# EAGLE design DualEncoderBoard-v1.0 (EAGLE 6.5.0)
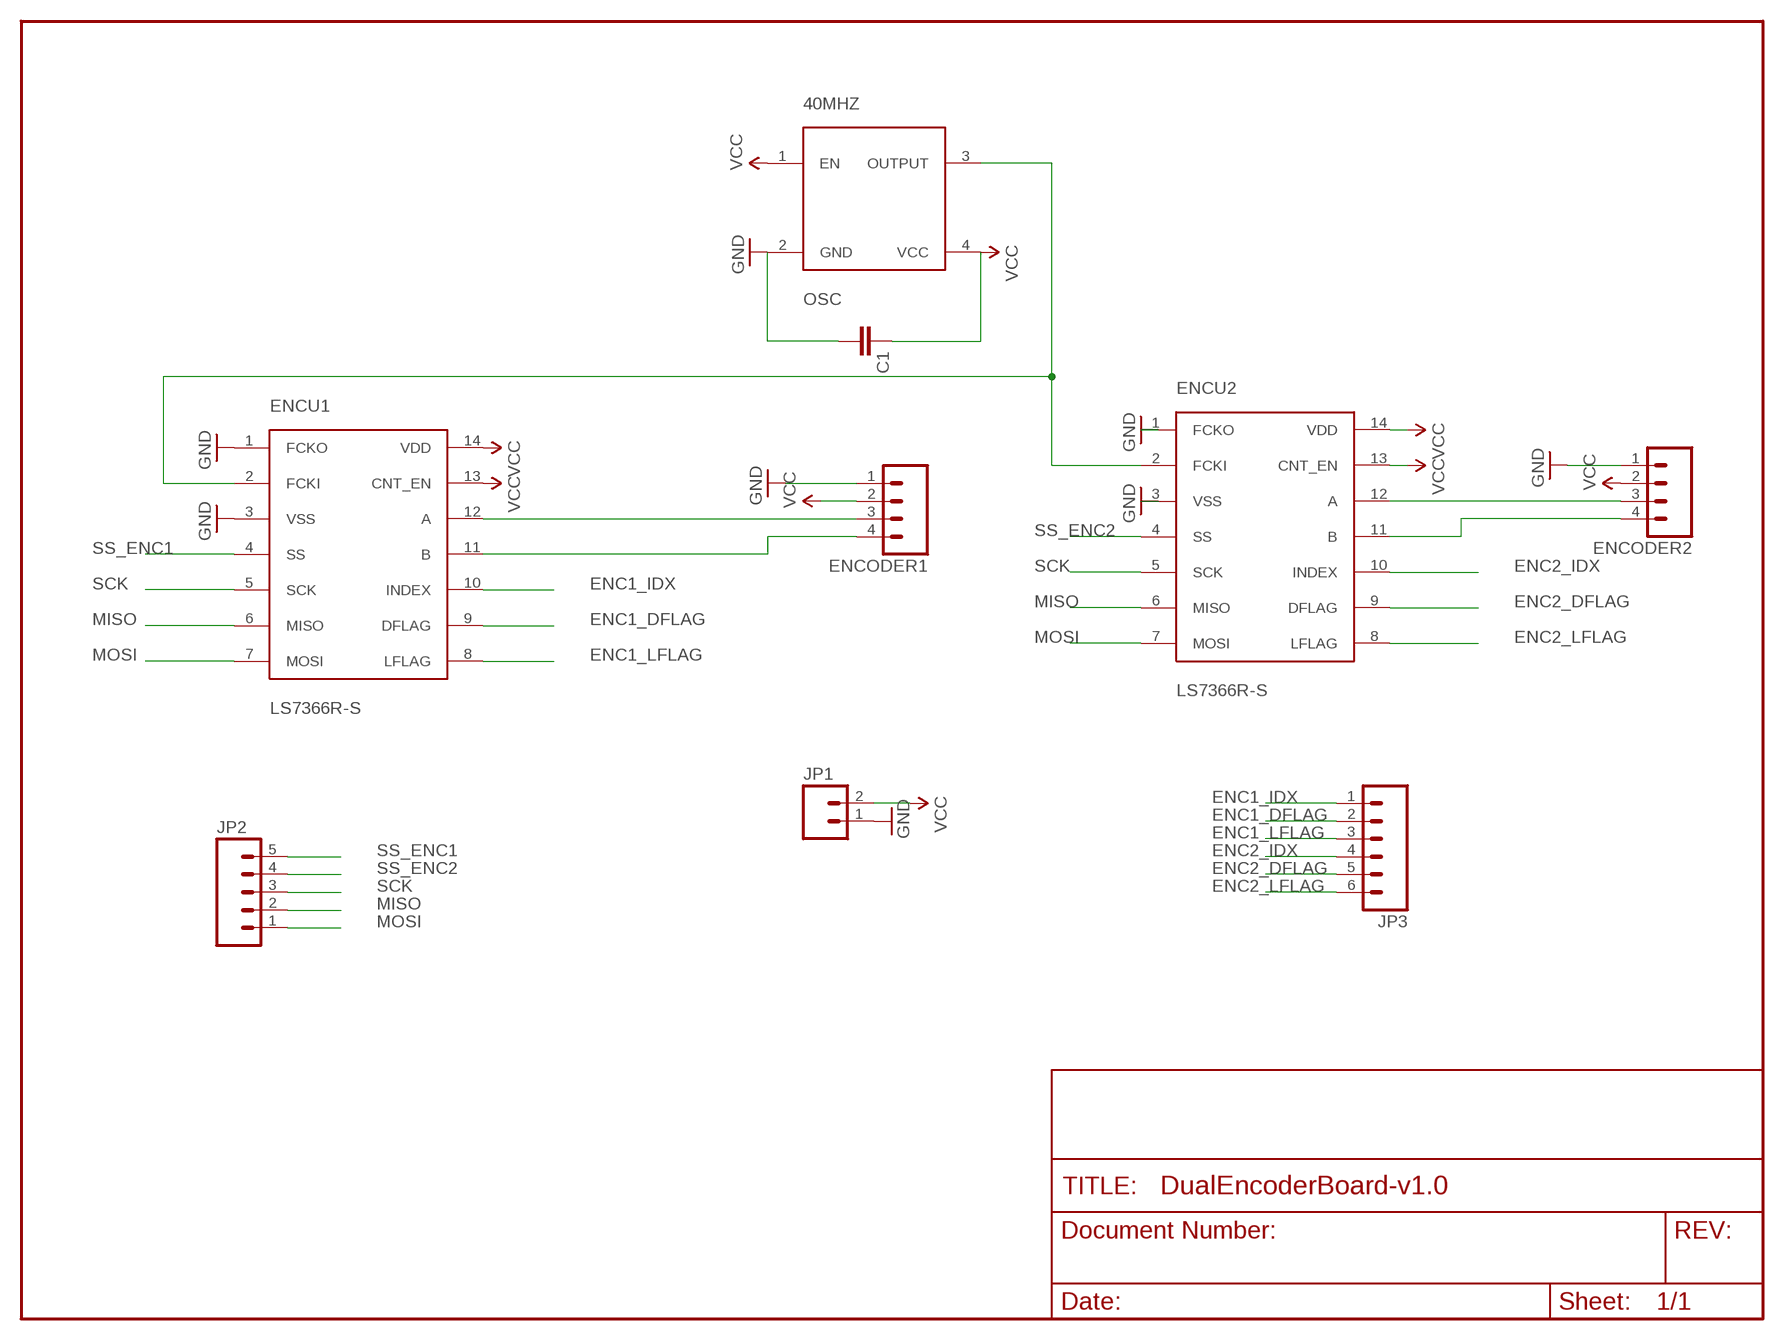
[diagram p0: schematic, sheet 1]

## Parts
40MHZ  OSC  [CB3OSCILLATOR]
C1  CAPKIT  [CAP-PTH-SMALL-KIT]
ENCODER1  M04POLAR  [MOLEX-1X4]
ENCODER2  M04POLAR  [MOLEX-1X4]
ENCU1  LS7366R-S  [SO14]
ENCU2  LS7366R-S  [SO14]
JP1  M02-JST-2MM-SMT  [JST-2-SMD]
JP2  M05PTH  [1X05]
JP3  M06SIP  [1X06]

## Nets
ENC1_DFLAG: ENCU1.9(DFLAG) JP3.2
ENC1_IDX: ENCU1.10(INDEX) JP3.1
ENC1_LFLAG: ENCU1.8(LFLAG) JP3.3
ENC2_DFLAG: ENCU2.9(DFLAG) JP3.5
ENC2_IDX: ENCU2.10(INDEX) JP3.4
ENC2_LFLAG: ENCU2.8(LFLAG) JP3.6
GND: 40MHZ.2(GND) C1.2 ENCODER1.1 ENCODER2.1 ENCU1.1(FCKO) ENCU1.3(VSS) ENCU2.1(FCKO) ENCU2.3(VSS) JP1.1
MISO: ENCU1.6(MISO) ENCU2.6(MISO) JP2.2
MOSI: ENCU1.7(MOSI) ENCU2.7(MOSI) JP2.1
N$1: ENCODER1.3 ENCU1.12(A)
N$2: ENCODER1.4 ENCU1.11(B)
N$3: ENCODER2.3 ENCU2.12(A)
N$4: ENCODER2.4 ENCU2.11(B)
N$5: 40MHZ.3(OUTPUT) ENCU1.2(FCKI) ENCU2.2(FCKI)
SCK: ENCU1.5(SCK) ENCU2.5(SCK) JP2.3
SS_ENC1: ENCU1.4(SS) JP2.5
SS_ENC2: ENCU2.4(SS) JP2.4
VCC: 40MHZ.1(EN) 40MHZ.4(VCC) C1.1 ENCODER1.2 ENCODER2.2 ENCU1.13(CNT_EN) ENCU1.14(VDD) ENCU2.13(CNT_EN) ENCU2.14(VDD) JP1.2

## Library data of the parts
40MHZ = steveo:OSC: CB3 40mhz Oscillator smd
C1 = SparkFun:CAP: Capacitor Standard 0603 ceramic capacitor, and 0.1" leaded capacitor.
ENCODER1 ENCODER2 = SparkFun:M04: Header 4 Standard 4-pin 0.1" header. Use with straight break away headers (SKU : PRT-00116), right angle break away headers (PRT-00553), swiss pins (PRT-00743), machine pins (PRT-00117), and female headers (PRT-00115). Molex polarized connector foot print use with SKU : PRT-08231 with associated crimp pins and housings. 1MM SMD Version SKU: PRT-10208
ENCU1 ENCU2 = steveo:LS7366R-S
JP1 = SparkFun:M02: Header 2 Standard 2-pin 0.1" header. Use with straight break away headers (SKU : PRT-00116), right angle break away headers (PRT-00553), swiss pins (PRT-00743), machine pins (PRT-00117), and female headers (PRT-00115). Molex polarized connector foot print use with SKU : PRT-08233 with associated crimp pins and housings.
JP2 = SparkFun:M05: Header 5 Standard 5-pin 0.1" header. Use with straight break away headers (SKU : PRT-00116), right angle break away headers (PRT-00553), swiss pins (PRT-00743), machine pins (PRT-00117), and female headers (PRT-00115). Molex polarized connector foot print use with SKU : PRT-08230 with associated crimp pins and housings.
JP3 = SparkFun:M06: Header 6 Standard 6-pin 0.1" header. Use with straight break away headers (SKU : PRT-00116), right angle break away headers (PRT-00553), swiss pins (PRT-00743), machine pins (PRT-00117), and female headers (PRT-00115). Molex polarized connector foot print use with SKU : PRT-08094 with associated crimp pins and housings. NOTES ON THE VARIANTS LOCK and LOCK_LONGPADS... This footprint was designed to help hold the alignment of a through-hole component (i.e. 6-pin header) while soldering it into place. You may notice that each hole has been shifted either up or down by 0.005 of an inch from it's more standard position (which is a perfectly straight line). This slight alteration caused the pins (the squares in the middle) to touch the edges of the holes. Because they are alternating, it causes a "brace" to hold the component in place. 0.005 has proven to be the perfect amount of "off-center" position when using our standard breakaway headers. Although looks a little odd when you look at the bare footprint, once you have a header in there, the alteration is very hard to notice. Also, if you push a header all the way into place, it is covered up entirely on the bottom side. This idea of altering the position of holes to aid alignment will be further integrated into the Sparkfun Library for other footprints. It can help hold any component with 3 or more connection pins.

## Board
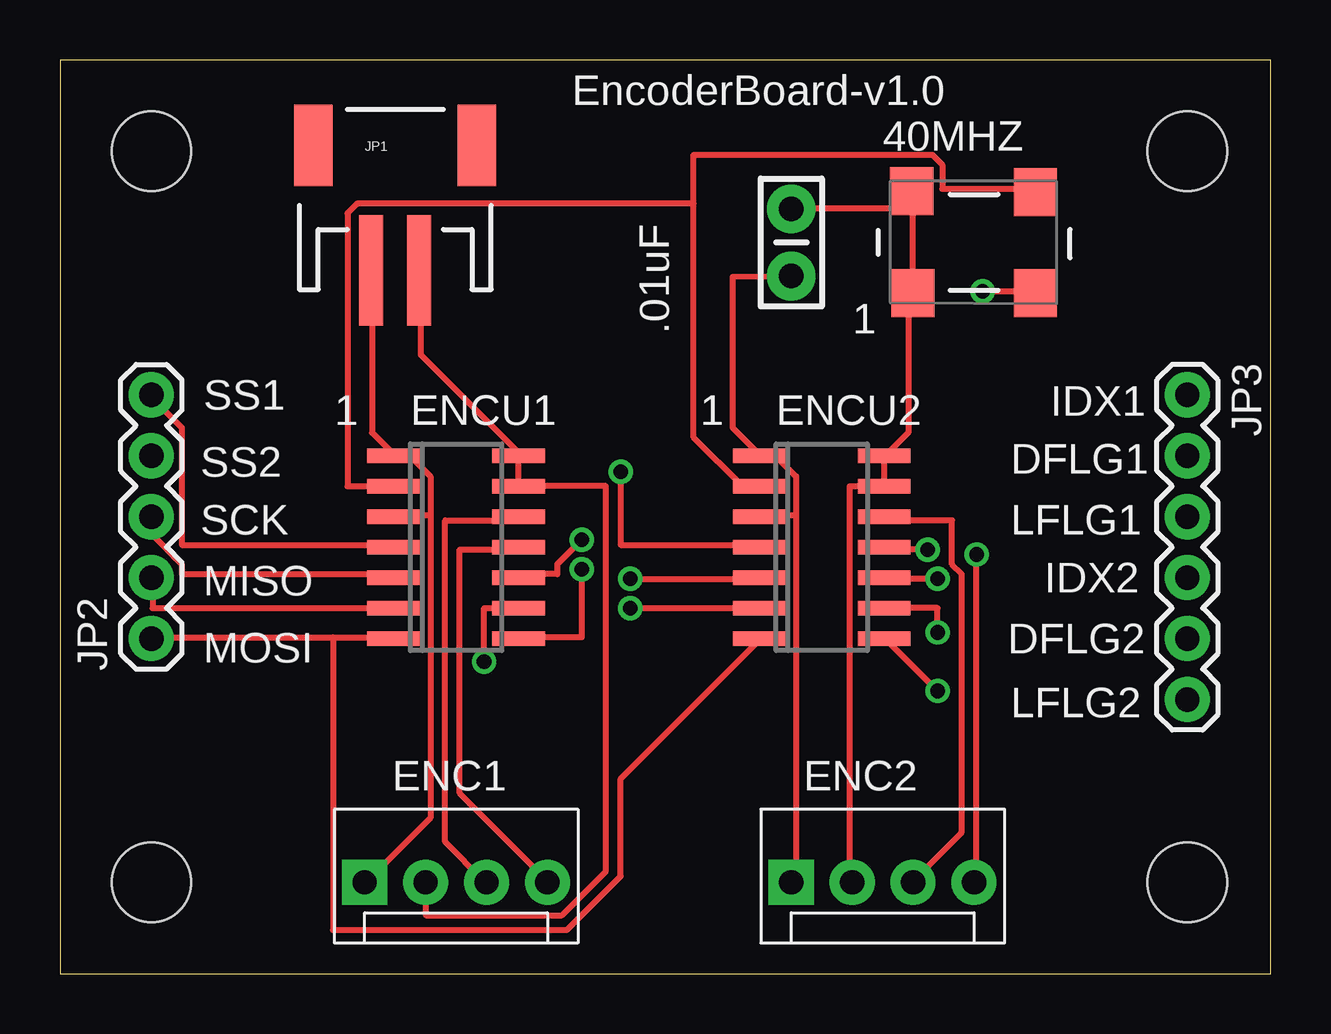
[diagram p1: board, top side]
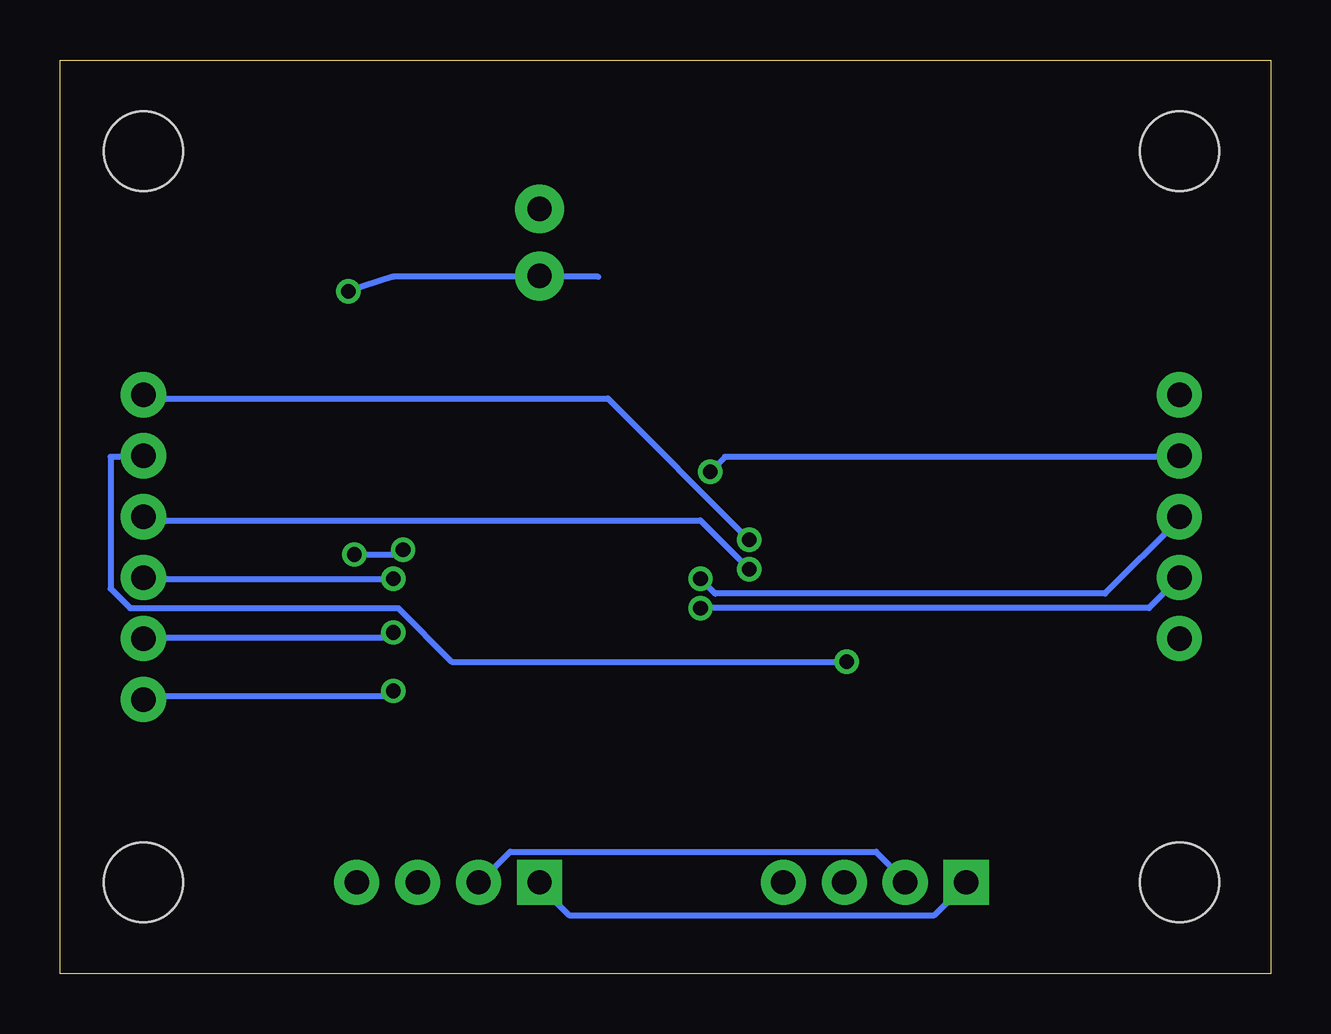
[diagram p2: board, bottom side, seen from below]

Size 50.47 x 38.09 mm. Coordinates in mm from the lower left corner, seen from the top.
Outline: 0,0 50.47,0 50.47,38.09 0,38.09 0,0
Copper layers (1*16): Top 0.035mm / dielectric 1.5mm / Bottom 0.035mm
Design rules "default": minimum track width 10mil, minimum drill 24mil, track to track 8mil, track to pad 8mil, pad to pad 8mil, via to via 8mil, smd to smd 8mil, copper to edge 40mil, drill to drill 8mil, minimum pad ring 10mil, minimum via ring 8mil, stop-mask expansion 4mil, vias tented up to drill 0mil, thermal gap 10mil

### Footprints (pad centres in the part's own frame; a part is rotated, then mirrored left to right if it is on the bottom)
CB3OSCILLATOR = smd 1.8 x 2: 1 -2.55,-2.1; 2 2.55,-2.1; 3 2.55,2.1; 4 -2.6,2.15
CAP-PTH-SMALL-KIT = drill 1.016 pad 2.032: 1 -1.397,0; 2 1.397,0
MOLEX-1X4 = drill 1.016 pad 1.88 square: 1 0,0 | drill 1.016 pad 1.88: 2 2.54,0; 3 5.08,0; 4 7.62,0
SO14 = smd 0.6 x 2.2: 1 -3.81,-2.6; 2 -2.54,-2.6; 3 -1.27,-2.6; 4 0,-2.6; 5 1.27,-2.6; 6 2.54,-2.6; 7 3.81,-2.6; 8 3.81,2.6; 9 2.54,2.6; 10 1.27,2.6; 11 0,2.6; 12 -1.27,2.6; 13 -2.54,2.6; 14 -3.81,2.6
JST-2-SMD = smd 1 x 4.6: 1 -1,-3.7; 2 1,-3.7 | smd 1.6 x 3.4: NC1 -3.4,1.5; NC2 3.4,1.5
1X05 = drill 1.016 pad 1.88: 1 0,0; 2 2.54,0; 3 5.08,0; 4 7.62,0; 5 10.16,0
1X06 = drill 1.016 pad 1.88: 1 0,0; 2 2.54,0; 3 5.08,0; 4 7.62,0; 5 10.16,0; 6 12.7,0
STAND-OFF = hole 3.302: 0,0

### Placement (x,y rotation side)
40MHZ  38.1,30.48 0 top
C1  30.48,30.48 270 top
ENCODER1  12.7,3.81 0 top
ENCODER2  30.48,3.81 0 top
ENCU1  16.51,17.78 270 top
ENCU2  31.75,17.78 270 top
JP1  13.97,33.02 0 top
JP2  3.81,13.97 90 top
JP3  46.99,24.13 270 top
U$1  [STAND-OFF]  3.81,34.29 0 top
U$2  [STAND-OFF]  46.99,34.29 0 top
U$3  [STAND-OFF]  46.99,3.81 0 top
U$4  [STAND-OFF]  3.81,3.81 0 top

### Tracks (layer width: path | path; a pad name or v marks a point on that pad's centre or on a via)
ENC1_DFLAG  (via drill 0.61)
  Top 0.254: ENCU1.9 17.68,15.24 v17.68,13.01
  Bottom 0.254: v17.68,13.01 34.14,13.01 36.37,15.24 47.55,15.24 48.36,16.05 48.36,21.54 47.14,21.54 JP3.2
ENC1_IDX  (via drill 0.61)
  Top 0.254: v21.74,18.09 20.73,17.07 20.73,16.66 19.3,16.66 ENCU1.10
  Bottom 0.254: v21.74,18.09 27.64,23.98 46.94,23.98 JP3.1
ENC1_LFLAG  (via drill 0.61)
  Top 0.254: v21.74,16.87 21.74,14.02 19.3,14.02 ENCU1.8
  Bottom 0.254: v21.74,16.87 23.77,18.9 46.94,18.9 JP3.3
ENC2_DFLAG  (via drill 0.61)
  Top 0.254: ENCU2.9 36.58,15.24 v36.58,14.22
  Bottom 0.254: v36.58,14.22 36.78,14.02 46.94,14.02 JP3.5
ENC2_IDX  (via drill 0.61)
  Top 0.254: v36.58,16.46 34.54,16.46 ENCU2.10
  Bottom 0.254: v36.58,16.46 46.94,16.46 JP3.4
ENC2_LFLAG  (via drill 0.61)
  Top 0.254: v36.58,11.79 34.54,13.82 ENCU2.8
  Bottom 0.254: v36.58,11.79 36.78,11.58 46.94,11.58 JP3.6
GND  (via drill 0.61)
  Top 0.254: 15.44,19.1 14.02,19.1 ENCU1.3 | 15.44,19.1 15.44,20.73 14.63,21.54 14.02,21.54 ENCU1.1 13.82,21.74 13.01,22.55 13.01,29.26 JP1.1 | 15.44,19.1 15.44,6.5 12.8,3.86 ENCODER1.1 | 30.68,19.1 29.26,19.1 ENCU2.3 | 30.68,19.1 30.68,20.73 29.87,21.54 29.26,21.54 ENCU2.1 29.06,21.74 28.04,22.76 28.04,29.06 C1.2 | v38.46,28.45 40.64,28.45 40MHZ.2 | 30.68,19.1 30.68,4.06 30.48,3.86 ENCODER2.1
  Bottom 0.254: v38.46,28.45 36.58,29.06 28.04,29.06 C1.2 | ENCODER1.1 12.8,3.66 14.02,2.44 29.26,2.44 30.48,3.66 ENCODER2.1
MISO  (via drill 0.61)
  Top 0.254: ENCU1.6 3.86,15.24 3.86,16.46 JP2.2 | v23.77,15.24 ENCU2.6
  Bottom 0.254: v23.77,15.24 5.08,15.24 JP2.2
MOSI
  Top 0.254: 11.38,14.02 3.86,14.02 JP2.1 | 11.38,14.02 13.82,14.02 ENCU1.7 | 11.38,14.02 11.38,1.83 21.13,1.83 23.37,4.06 23.37,8.13 29.06,13.82 ENCU2.7
N$1
  Top 0.254: ENCU1.12 19.1,18.9 16.05,18.9 16.05,5.49 17.68,3.86 ENCODER1.3
N$2
  Top 0.254: ENCU1.11 19.1,17.68 16.66,17.68 16.66,7.52 20.32,3.86 ENCODER1.4
N$3
  Top 0.254: ENCU2.12 34.54,18.9 37.19,18.9 37.19,17.07 37.59,16.66 37.59,5.89 35.56,3.86 ENCODER2.3
N$4  (via drill 0.61)
  Top 0.254: v36.17,17.68 34.54,17.68 ENCU2.11 | v38.2,17.48 38.2,3.86 ENCODER2.4
  Bottom 0.254: v36.17,17.68 36.37,17.48 v38.2,17.48
N$5
  Top 0.254: 26.42,32.11 26.42,22.35 28.45,20.32 ENCU2.2 | 26.42,32.11 26.42,34.14 36.37,34.14 36.78,33.73 36.78,32.72 40.64,32.72 40MHZ.3 | ENCU1.2 11.99,20.32 11.99,31.7 12.39,32.11 26.42,32.11
SCK  (via drill 0.61)
  Top 0.254: ENCU1.5 13.82,16.66 5.08,16.66 5.08,17.07 3.86,18.29 3.86,18.9 JP2.3 | v23.77,16.46 29.06,16.46 ENCU2.5
  Bottom 0.254: v23.77,16.46 23.16,15.85 6.91,15.85 3.86,18.9 JP2.3
SS_ENC1
  Top 0.254: ENCU1.4 13.82,17.88 5.08,17.88 5.08,22.76 3.86,23.98 JP2.5
SS_ENC2  (via drill 0.61)
  Top 0.254: v23.37,20.93 23.37,17.88 29.06,17.88 ENCU2.4
  Bottom 0.254: v23.37,20.93 22.76,21.54 3.86,21.54 JP2.4
VCC
  Top 0.254: ENCU2.13 34.34,21.54 ENCU2.14 34.54,21.74 35.36,22.55 35.36,28.25 40MHZ.1 35.56,28.45 35.56,31.9 | 35.56,31.9 35.56,32.51 40MHZ.4 35.56,31.9 | 35.56,31.9 30.58,31.9 C1.1 | JP1.2 15.04,29.26 15.04,25.81 19.1,21.74 ENCU1.14 19.1,21.54 ENCU1.13 22.76,20.32 22.76,4.27 20.93,2.44 15.24,2.44 ENCODER1.2 | ENCU2.13 32.92,20.32 32.92,3.86 ENCODER2.2 | ENCU2.13
  Bottom 0.254: ENCODER1.2 15.24,3.86 16.46,5.08 31.7,5.08 32.92,3.86 ENCODER2.2

### Text on the board
tPlace: EncoderBoard-v1.0 | .01uF | 1 | SS1 | 1 | 1 | IDX1 | SS2 | DFLG1 | SCK | LFLG1 | MISO | IDX2 | MOSI | DFLG2 | LFLG2 | ENC1 | ENC2